# Altium schematic sheet Current Sensor.SchDoc
size A4; SheetNumber: 4; SheetTotal: 10
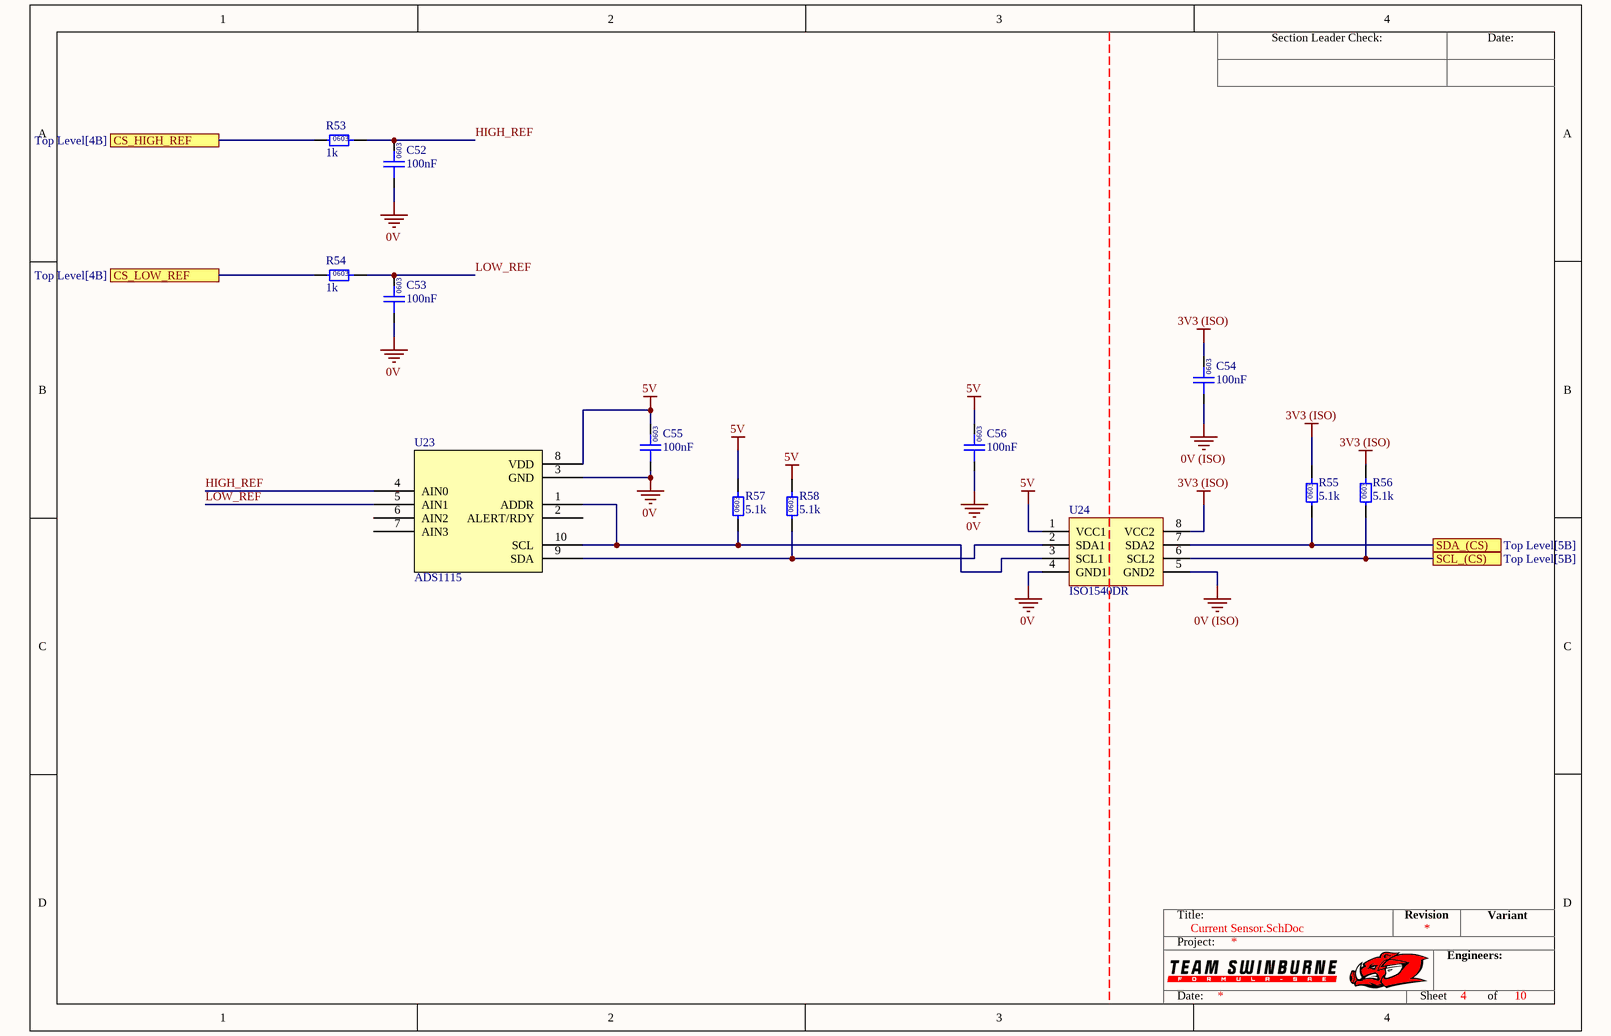
[diagram p0: Current Sensor.SchDoc]

## Parts
C52  100nF  [0603]
C53  100nF  [0603]
C54  100nF  [0603]
C55  100nF  [0603]
C56  100nF  [0603]
R53  1k  [0603]
R54  1k  [0603]
R55  5.1k  [0603]
R56  5.1k  [0603]
R57  5.1k  [0603]
R58  5.1k  [0603]
U23  ADS1115  [TI 10-VSSOP]
U24  ISO1540DR  [TI 8-SOIC]

## Ports
CS_HIGH_REF (see Top Level[4B]), CS_LOW_REF (see Top Level[4B]), SCL_(CS) (see Top Level[5B]), SDA_(CS) (see Top Level[5B])

## Nets
0V: C52.1 C53.1 C55.1 C56.1 U23.3(GND) U24.4(GND1)
0V (ISO): C54.1 U24.5(GND2)
3V3 (ISO): C54.2 R55.2 R56.2 U24.8(VCC2)
5V: C55.2 C56.2 R57.2 R58.2 U23.8(VDD) U24.1(VCC1)
CS_HIGH_REF: R53.1 ; port CS_HIGH_REF
CS_LOW_REF: R54.1 ; port CS_LOW_REF
HIGH_REF: C52.2 R53.2 U23.4(AIN0)
LOW_REF: C53.2 R54.2 U23.5(AIN1)
SCL_(CS): R56.1 U24.6(SCL2) ; port SCL_(CS)
SDA_(CS): R55.1 U24.7(SDA2) ; port SDA_(CS)
NetR57_1: R57.1 U23.1(ADDR) U23.10(SCL) U24.3(SCL1)
NetR58_1: R58.1 U23.9(SDA) U24.2(SDA1)

Not connected (* = marked no-connect by the designer): U23 2(ALERT/RDY) 6(AIN2) 7(AIN3)

## Notes on the sheet
- Section Leader Check:
- Date:
- Title:
- Revision
- Variant
- Project:
- Engineers:
- Sheet
- of
- (in symbol GCM188L81H104KA57D) 0603
- (in symbol RC0603FR-071KL) 0603
- (in symbol RC0603JR-075K1L) 0603

## Library data of the parts
C52-C56 = GCM188L81H104KA57D: Manufacturer: muRata; Rated Voltage: 50V; Tolerance: ±10%; Material: MLCC; Temperature Rating: X8L; Part Number: GCM188L81H104KA57D; Value: 100nF; Digikey Part Number: 490-6049-1-ND
R53 R54 = RC0603FR-071KL: Manufacturer: YAGEO; Tolerance: 0.01; Rated Power: 0.1W; Part Number: RC0603FR-071KL; Value: 1k; Material: FR-07; Digikey Part Number: 311-1.00KHRCT-ND
R55-R58 = RC0603JR-075K1L: Manufacturer: YAGEO; Tolerance: 0.01; Rated Power: 0.1W; Part Number: RC0603JR-075K1L; Value: 5.1k; Material: FR-07; Digikey Part Number: 311-5.1KGRCT-ND
U23 = ADS1115: 16 Bit Analog to Digital Converter 2, 4 Input 1 Sigma-Delta 10-VSSOP; Manufacturer: Texas Instruments; Part Number: ADS1115; Digikey Part Number: 296-38849-1-ND
U24 = ISO1540DR: I2C Digital Isolator (Multichannel); Manufacturer: Texas Instruments; Part Number: ISO1540DR; Digikey Part Number: 296-34871-1-ND; Digikey Link: https://www.digikey.com/product-detail/en/texas-instruments/ISO1540DR/296-34871-1-ND/3587214